# Altium schematic sheet temperature_controller.SchDoc
size A4
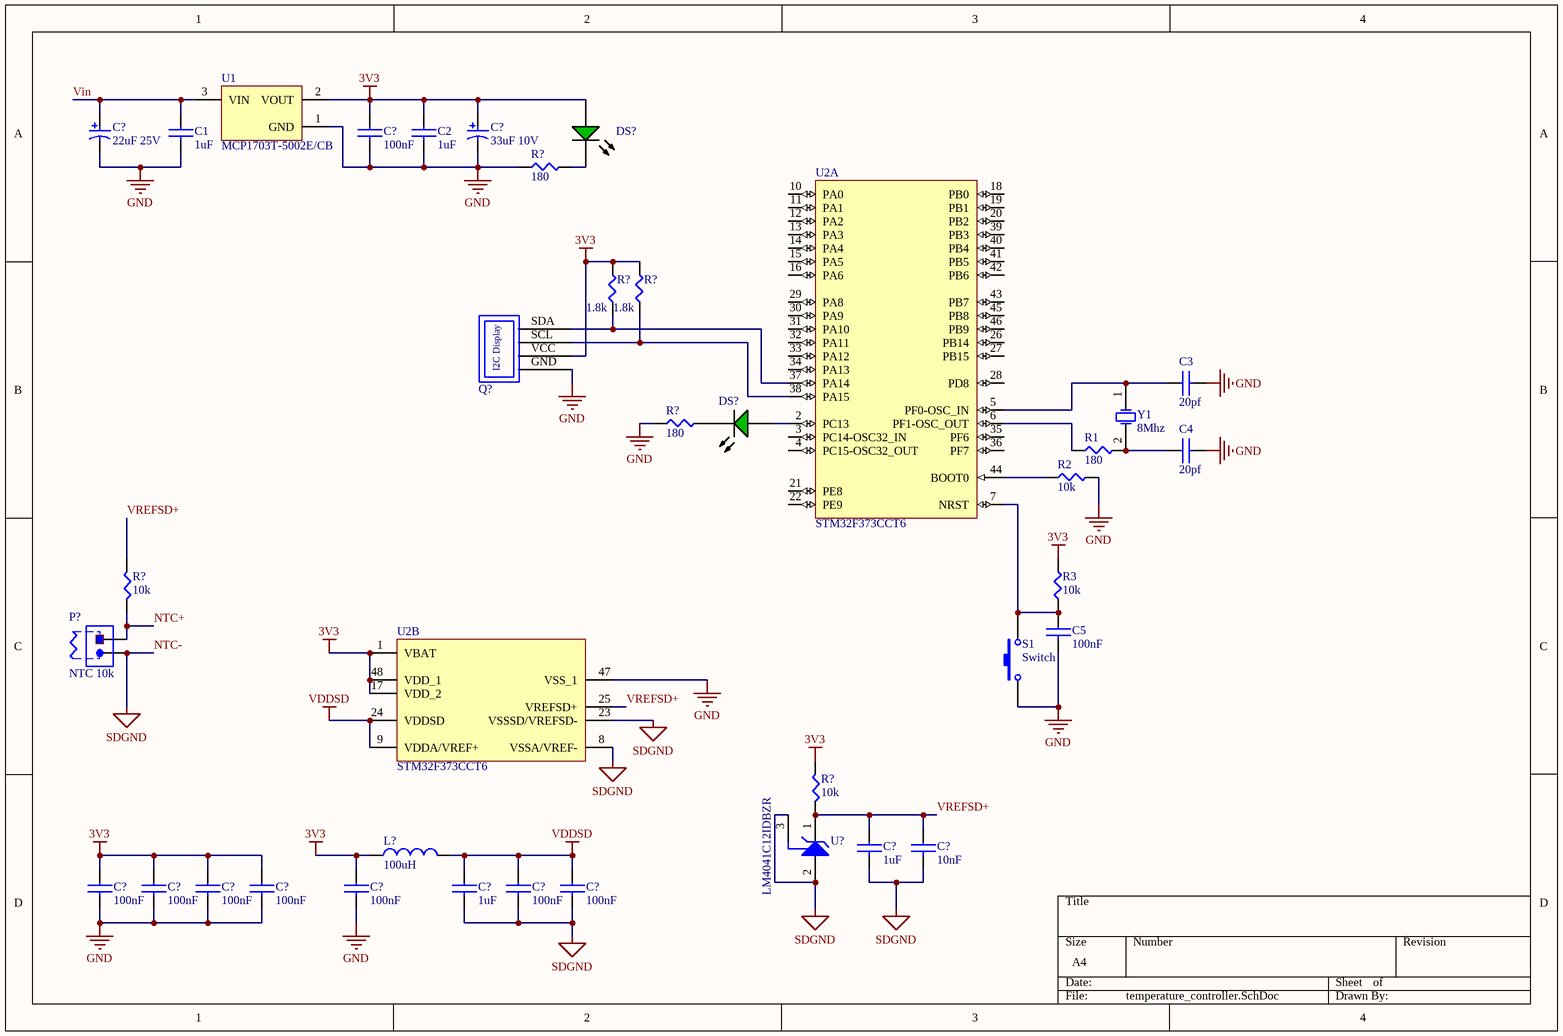
[diagram p0: temperature_controller.SchDoc]

## Parts
(Parts that share a designator on the sheet are numbered #1, #2 ... from top to bottom, then left to right.)
C1  1uF  [CAPC160X80X90L35N]
C2  1uF  [CAPC160X80X90L35N]
C3  20pf  [CAPC160X80X90L35N]
C4  20pf  [CAPC160X80X90L35N]
C5  100nF  [CAPC160X80X90L35N]
C?#1  22uF 25V  [PNSC-FP-V-C_V]
C?#2  33uF 10V  [NIC-CAPA2-5X5.8_V]
C?#3  100nF  [CAPC160X80X90L35N]
C?#4  1uF  [CAPC160X80X90L35N]
C?#5  10nF  [CAPC160X80X90L35N]
C?#6  100nF  [CAPC160X80X90L35N]
C?#7  100nF  [CAPC160X80X90L35N]
C?#8  100nF  [CAPC160X80X90L35N]
C?#9  100nF  [CAPC160X80X90L35N]
C?#10  100nF  [CAPC160X80X90L35N]
C?#11  1uF  [CAPC160X80X90L35N]
C?#12  100nF  [CAPC160X80X90L35N]
C?#13  100nF  [CAPC160X80X90L35N]
DS?#1  19-217/GHC-YR1S2/3T  [LEDC160X80X60L30N]  (value not drawn)
DS?#2  19-217/GHC-YR1S2/3T  [LEDC160X80X60L30N]  (value not drawn)
L?  100uH  [INDC210X125X100L50N]
P?  NTC 10k  [TWO PADS]
Q?  SSD1306 OLED  [SSD1306 OLED]  (value not drawn)
R1  180  [RESC160X80X90L30N]
R2  10k  [RESC160X80X90L30N]
R3  10k  [RESC160X80X90L30N]
R?#1  180  [SMD-0805-RES]
R?#2  1.8k  [RESC160X80X90L30N]
R?#3  1.8k  [RESC160X80X90L30N]
R?#4  180  [SMD-0805-RES]
R?#5  10k  [RESC160X80X90L30N]
R?#6  10k  [RESC160X80X90L30N]
S1  Switch  [SPST-2]
U1  MCP1703T-5002E/CB  [SOT-23A-CB3_M]
U2  STM32F373CCT6  [STM-LQFP48_L]  (parts A,B of 2)
U?  LM4041C12IDBZR  [DBZ0003A_N]
Y1  8Mhz  [5032]

## Nets
3V3: C2.1 C?#2.1 C?#3.1 C?#6.1 C?#7.1 C?#8.1 C?#9.1 C?#10.1 DS?#1.A L?.1 Q?.VCC R3.2 R?#2.2 R?#3.2 R?#6.2 U1.2(VOUT) U2.1(VBAT) U2.17(VDD_2) U2.48(VDD_1)
GND: C1.2 C2.2 C3.2 C4.2 C5.2 C?#1.2 C?#2.2 C?#3.2 C?#6.2 C?#7.2 C?#8.2 C?#9.2 C?#10.2 Q?.GND R2.2 R?#1.1 R?#4.1 S1.1 U1.1(GND) U2.47(VSS_1)
NTC-: C?#4.2 C?#5.2 C?#11.2 C?#12.2 C?#13.2 P?.1 U2.8(VSSA/VREF-) U2.23(VSSSD/VREFSD-) U?.2(ANODE) U?.3(NC)  [also labelled SDGND]
VDDSD: C?#11.1 C?#12.1 C?#13.1 L?.2 U2.9(VDDA/VREF+) U2.24(VDDSD)
NTC+: P?.2 R?#5.1
Vin: C1.1 C?#1.1 U1.3(VIN)
VREFSD+: C?#4.1 C?#5.1 R?#5.2 R?#6.1 U2.25(VREFSD+) U?.1(CATHODE)
NetC3_1: C3.1 U2.5(PF0-OSC_IN) Y1.1(OSC1)
NetC4_1: C4.1 R1.2 Y1.2(OSC2)
NetC5_1: C5.1 R3.1 S1.2 U2.7(NRST)
NetDS?#1_C: DS?#1.C R?#1.2
NetDS?#2_A: DS?#2.A U2.2(PC13)
NetDS?#2_C: DS?#2.C R?#4.2
NetQ?_SCL: Q?.SCL R?#3.1 U2.38(PA15)
NetQ?_SDA: Q?.SDA R?#2.1 U2.37(PA14)
NetR1_1: R1.1 U2.6(PF1-OSC_OUT)
NetR2_1: R2.1 U2.44(BOOT0)

Not connected (* = marked no-connect by the designer): U2 3(PC14-OSC32_IN) 4(PC15-OSC32_OUT) 10(PA0) 11(PA1) 12(PA2) 13(PA3) 14(PA4) 15(PA5) 16(PA6) 18(PB0) 19(PB1) 20(PB2) 21(PE8) 22(PE9) 26(PB14) 27(PB15) 28(PD8) 29(PA8) 30(PA9) 31(PA10) 32(PA11) 33(PA12) 34(PA13) 35(PF6) 36(PF7) 39(PB3) 40(PB4) 41(PB5) 42(PB6) 43(PB7) 45(PB8) 46(PB9)

## Notes on the sheet
- (in symbol SSD1306 OLED) I2C Display

## Library data of the parts
C1 C2 C?#4 C?#11 = capacitor: Part Number: CL10A105KB8NNNC; Value: 1uF; LCSC Part #: C15849
C3 C4 = capacitor: Part Number: CL10C200JB8NNNC; Value: 20pf; LCSC Part #: C1648
C5 C?#3 C?#6-C?#10 C?#12 C?#13 = capacitor: Part Number: CC0603KRX7R9BB104; Value: 100nF; LCSC Part #: C14663
C?#1 = CMP-2000-06213-1: Aluminum Electrolytic Capacitor, 22 uF, +/- 20%, 25 V, 2-Pin SMD (Size Code C), -55 to 105 degC, RoHS, Tape and Reel; Manufacturer: Panasonic; ESR (Equivalent Series Resistance): 0.36O; Ripple Current: 240mA; Capacitance: 22µF; Lifetime@Temperature: 2000Hrs@105°C; Type: Can; Package Reference: FP-V-C; Package Description: 2-Pin Electrolytic Aluminum Capacitor, Body 5.3 x 5.3 mm; Operating Temp Range: -55to+105°C; Mounting Technology: SurfaceMount; Datasheet URL: http://industrial.panasonic.com/cdbs/www-data/pdf/RDE0000/ABA0000C1184.pdf; Case Size/Dimension: Ø5x5.8mm; Operating Temp-Max: 105°C; Package URL: http://industrial.panasonic.com/cdbs/www-data/pdf/RDE0000/DME0000COL48.pdf; Rated Voltage: 25V; Datasheet Version: 03/2016; Series: FP; Manufacturer URL: http://www.panasonic.com/; Value: 22uF; Voltage: 25V
C?#2 = CMP-0687-00022-1: Aluminum Electrolytic Capacitor, UD Series, Low Impedance, 33 uF, 10 V, + / - 20%, -55 to 105 degC, Chip Type, 5 x 5.8 mm D x L, Pb-Free, Reel; Manufacturer: Nichicon; PartNumber: UUD1A330MCL1GS; Rated Ripple Current (at 100kHz): 150 mA; Tolerance Rated Capacitance: -20 to 20%; Impedance: 0.76 Ohm; Packing: Dia382mm Reel; Endurance Time: 2000 h; ComponentLink2Description: Datasheet; ComponentLink1Description: Manufacturer URL; ComponentLink3URL: http://products.nichicon.co.jp/en/pdf/XJA043/e-ud.pdf; PackageDescription: 2-Pin Surface Mount Device, Diameter 5 mm, Height 5.8 mm, Pitch 4.4 mm; ComponentLink1URL: http://www.nichicon.co.jp/; PackageReference: CAPAE-D5H5.8; Rated Capacitance: 33 uF; Mounting Technology: Surface Mount; Rated Voltage: 10 V; ComponentLink2URL: http://products.nichicon.co.jp/en/pdf/XJA043/e-ud.pdf; ComponentLink3Description: Package Specification; Diameter: 5 mm; RoHS: TRUE; DatasheetVersion: 08/2012; Length: 5.8 mm; Value: 33uF; Voltage: 10V
C?#5 = capacitor: Part Number: 0603B103K500NT; Value: 10nF; LCSC Part #: C57112
DS?#1 DS?#2 = LED: Green LED; Part Number: 19-217/GHC-YR1S2/3T
L? = Inductor: Value: 100uH; Resistance: *; Package: *; LCSC Part #: C68035
P? = TWO PADS with NTC: Value: 1uF
Q? = SSD1306 OLED: I2C display
R1 R2 R?#1 R?#4 = Resistor: Part Number: *
  R1 R?#1 R?#4: Value: 180
  R2: Value: 10k
R3 R?#5 R?#6 = Resistor: Part Number: 0805W8F1002T5E; Value: 10k; LCSC Part #: C17414
R?#2 R?#3 = Resistor: Part Number: 0603WAF1801T5E; Value: 1.8k; LCSC Part #: C4177
U1 = CMP-0136-00758-1: 250 mA, 16V, Low Quiescent Current LDO Regulator, 3-Pin SOT-23A, Extended Temperature, Tape and Reel; PackageReference: SOT-23A-CB3; PackageVersion: revBB, Aug-2009; DatasheetVersion: revD, Sep-2009; PackageDescription: 3-Lead Plastic Small Outline Transistor (CB) [SOT-23A]; Part Number: MCP1703
U2 = CMP-0572-00021-2: ARM Cortex-M4 32-bit MCU, 256 KB Flash, 32 KB Internal RAM, 36 I/Os, 48-pin LQFP, -40 to 85 degC, Tray; FLASH Size (Prog) (kB): 256; Internal RAM Size (kB): 32; Operating Frequency(F) (Processor speed) (MHz): 72; I/Os (High Current): 36; Supply Voltage(Vcc) min (V): 2; Mounting Technology: Surface Mount; ComponentLink2Description: Datasheet; PackageReference: LQFP48; Packing: Tray; PackageVersion: Rev. 6, 06/2013; ComponentLink1Description: Manufacturer URL; ComponentLink3Description: Package Specification; ComponentLink2URL: http://www.st.com/st-web-ui/static/active/en/resource/technical/document/datasheet/DM00046749.pdf; PartNumber: STM32F373CCT6; Core: ARM Cortex-M4; ComponentLink1URL: http://www.st.com/web/en/home.html; ComponentLink3URL: http://www.st.com/st-web-ui/static/active/en/resource/technical/document/datasheet/DM00058181.pdf; DatasheetVersion: Rev. 3; PackageDescription: 48-Pin Low Profile Quad Flat Package, 7 x 7 mm Body, 0.5 mm Pitch
U? = CMP-0366-00994-2: Precision Micropower Shunt Voltage Reference, 0.5% accuracy, 1.2 V, 15 ppm / degC, 12 mA, -40 to 85 degC, 3-pin SOT-23 (DBZ), Green (RoHS & no Sb/Br); Manufacturer: Texas Instruments; Rating: Catalog; Temp Coeff(Max)(ppm/ degree C): 100; Min Iz for Regulation(uA): 60; Iout/Iz(Max)(mA): 12; Temp Coeff(Typ)(ppm/ degree C): 15; Initial Accuracy @ 25/deg C(%): 0.5; VO(V): 1.225; ComponentLink3URL: http://www.ti.com/litv/pdf/mpds108a; Code_JEDEC: TO-236; PackageVersion: 4203227/B; SubFamily: Shunt Voltage Reference; ComponentLink4Description: URL Link1; ComponentLink4URL: Samples URL:http://www.ti.com/product/lm4041c12; Mounting Technology: Surface Mount; ComponentLink1URL: http://www.ti.com/; ComponentLink2URL: http://www.ti.com/general/docs/lit/getliterature.tsp?genericPartNumber=LM4041C12&fileType=pdf; Eco-Plan: Green (RoHS & no Sb/Br); PackageReference: DBZ0003A; PackageDescription: 3-Pin Plastic Small Outline, Body 2.92 x 1.3 mm, Pitch 0.95 mm; PartNumber: LM4041C12IDBZR; DatasheetVersion: SLCS146E; ComponentLink2Description: Datasheet; ComponentLink1Description: Manufacturer URL; ComponentLink3Description: Package Specification
Y1 = XTAL: Crystal Oscillator; Part Number: X50328MSB2GI; Published: 8-Jun-2000; LatestRevisionDate: 17-Jul-2002; LatestRevisionNote: Re-released for DXP Platform.; PackageReference: R38; Publisher: Altium Limited; PackageDescription: Crystal, Thru-Hole; 2 Leads; Body 3.1 x 8.2 mm (Dia.xH); Value: 8Mhz
S1 = Switch: Published: 24-Mar-1999; LatestRevisionDate: 17-Jul-2002; LatestRevisionNote: Re-released for DXP Platform.; PackageReference: SPST-2; Publisher: Altium Limited; PackageDescription: Switch; 2 Leads